# Altium schematic sheet CH340T to TTL.SchDoc
size A4; Author: 万明亮; CompanyName: 洛阳双明电子研发设计工作室; Engineer: 万明亮; Organization: 洛阳双明电子研发设计工作室; Address1: 洛阳双明电子研发设计工作室   万明亮; Address2: Tel:13698891244; Address3: E-mail:lydzsj@126.com; Address4: QQ:lydzsj@126.com; PageSetup: Record=PageOptions|CenterHorizontal=True|CenterVertical=True|PrintScale=0.96|XCorrection=1.00|YCorrection=1.00|PrintKind=0|BorderSize=5000000|LeftOffset=0|BottomOffset=0|Orientation=2|PaperLength=1000|PaperWidth=1000|Scale=100|PaperSource=7|PrintQuality=-4|MediaType=1|DitherType=10|PaperKind=A4|PrintScaleMode=1
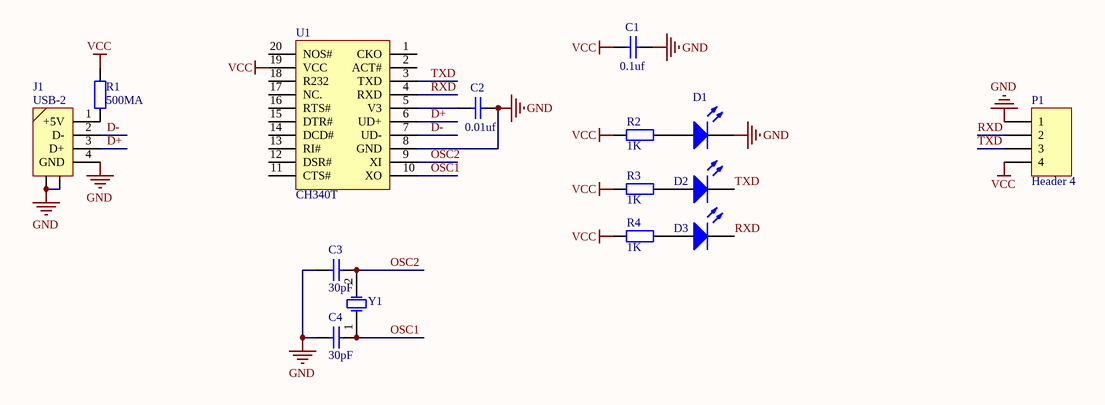
[diagram p0: CH340T to TTL.SchDoc]

## Parts
C1  value 0.1uf  [0805S]  (hidden comment: Cap)
C2  value 0.01uf  [0805S]  (hidden comment: Cap)
C3  value 30pF  [0805S]  (hidden comment: Cap)
C4  value 30pF  [0805S]  (hidden comment: Cap)
D1  LED  [LED0805]  (value not drawn)
D2  LED  [LED0805]  (value not drawn)
D3  LED  [LED0805]  (value not drawn)
J1  USB-2  [USB-SM-A]
P1  Header 4  [HDR1X4]
R1  value 500MA  [0805S]  (hidden comment: Res2)
R2  value 1K  [0805S]  (hidden comment: Res2)
R3  value 1K  [0805S]  (hidden comment: Res2)
R4  value 1K  [0805S]  (hidden comment: Res2)
U1  CH340T  [SSOP20]
Y1  XTAL  [XTAL-T3]  (value not drawn)

## Nets
GND: C1.1 C2.1 C3.2 C4.2 D1.2 J1.4(GND) J1.5 J1.6 P1.1 U1.8(GND)
VCC: C1.2 P1.4 R1.2 R2.1 R3.1 R4.1 U1.19(VCC)
D+: J1.3(D+) U1.6(UD+)
D-: J1.2(D-) U1.7(UD-)
OSC1: C4.1 U1.10(XO) Y1.1(OSC1)
OSC2: C3.1 U1.9(XI) Y1.2(OSC2)
RXD: D3.2 P1.2 U1.4(RXD)
TXD: D2.2 P1.3 U1.3(TXD)
NetC2_2: C2.2 U1.5(V3)
NetD1_1: D1.1 R2.2
NetD2_1: D2.1 R3.2
NetD3_1: D3.1 R4.2
NetJ1_1: J1.1(+5V) R1.1

Not connected (* = marked no-connect by the designer): U1 1(CKO) 2(ACT#) 11(CTS#) 12(DSR#) 13(RI#) 14(DCD#) 15(DTR#) 16(RTS#) 17(NC.) 18(R232) 20(NOS#)

## Library data of the parts
C1-C4 = Cap: Capacitor; Published: 8-Jun-2000; LatestRevisionDate: 17-Jul-2002; LatestRevisionNote: Re-released for DXP Platform.; Publisher: Altium Limited
D1-D3 = LED0: Typical INFRARED GaAs LED; Published: 8-Jun-2000; LatestRevisionDate: 08-Jul-2005; LatestRevisionNote: Mech Layer 1 removed.; PackageReference: LED-0; Publisher: Altium Limited
P1 = Header 4: Header, 4-Pin; LatestRevisionDate: 17-Jul-2002; LatestRevisionNote: Re-released for DXP Platform.; Publisher: Altium Limited
R1-R4 = Res2: Resistor; Published: 8-Jun-2000; LatestRevisionDate: 17-Jul-2002; LatestRevisionNote: Re-released for DXP Platform.; PackageReference: AXIAL-0.4; Publisher: Altium Limited
Y1 = XTAL: Crystal Oscillator; Published: 8-Jun-2000; LatestRevisionDate: 17-Jul-2002; LatestRevisionNote: Re-released for DXP Platform.; PackageReference: R38; Publisher: Altium Limited